# EAGLE design xplorer_t (EAGLE 6.3)
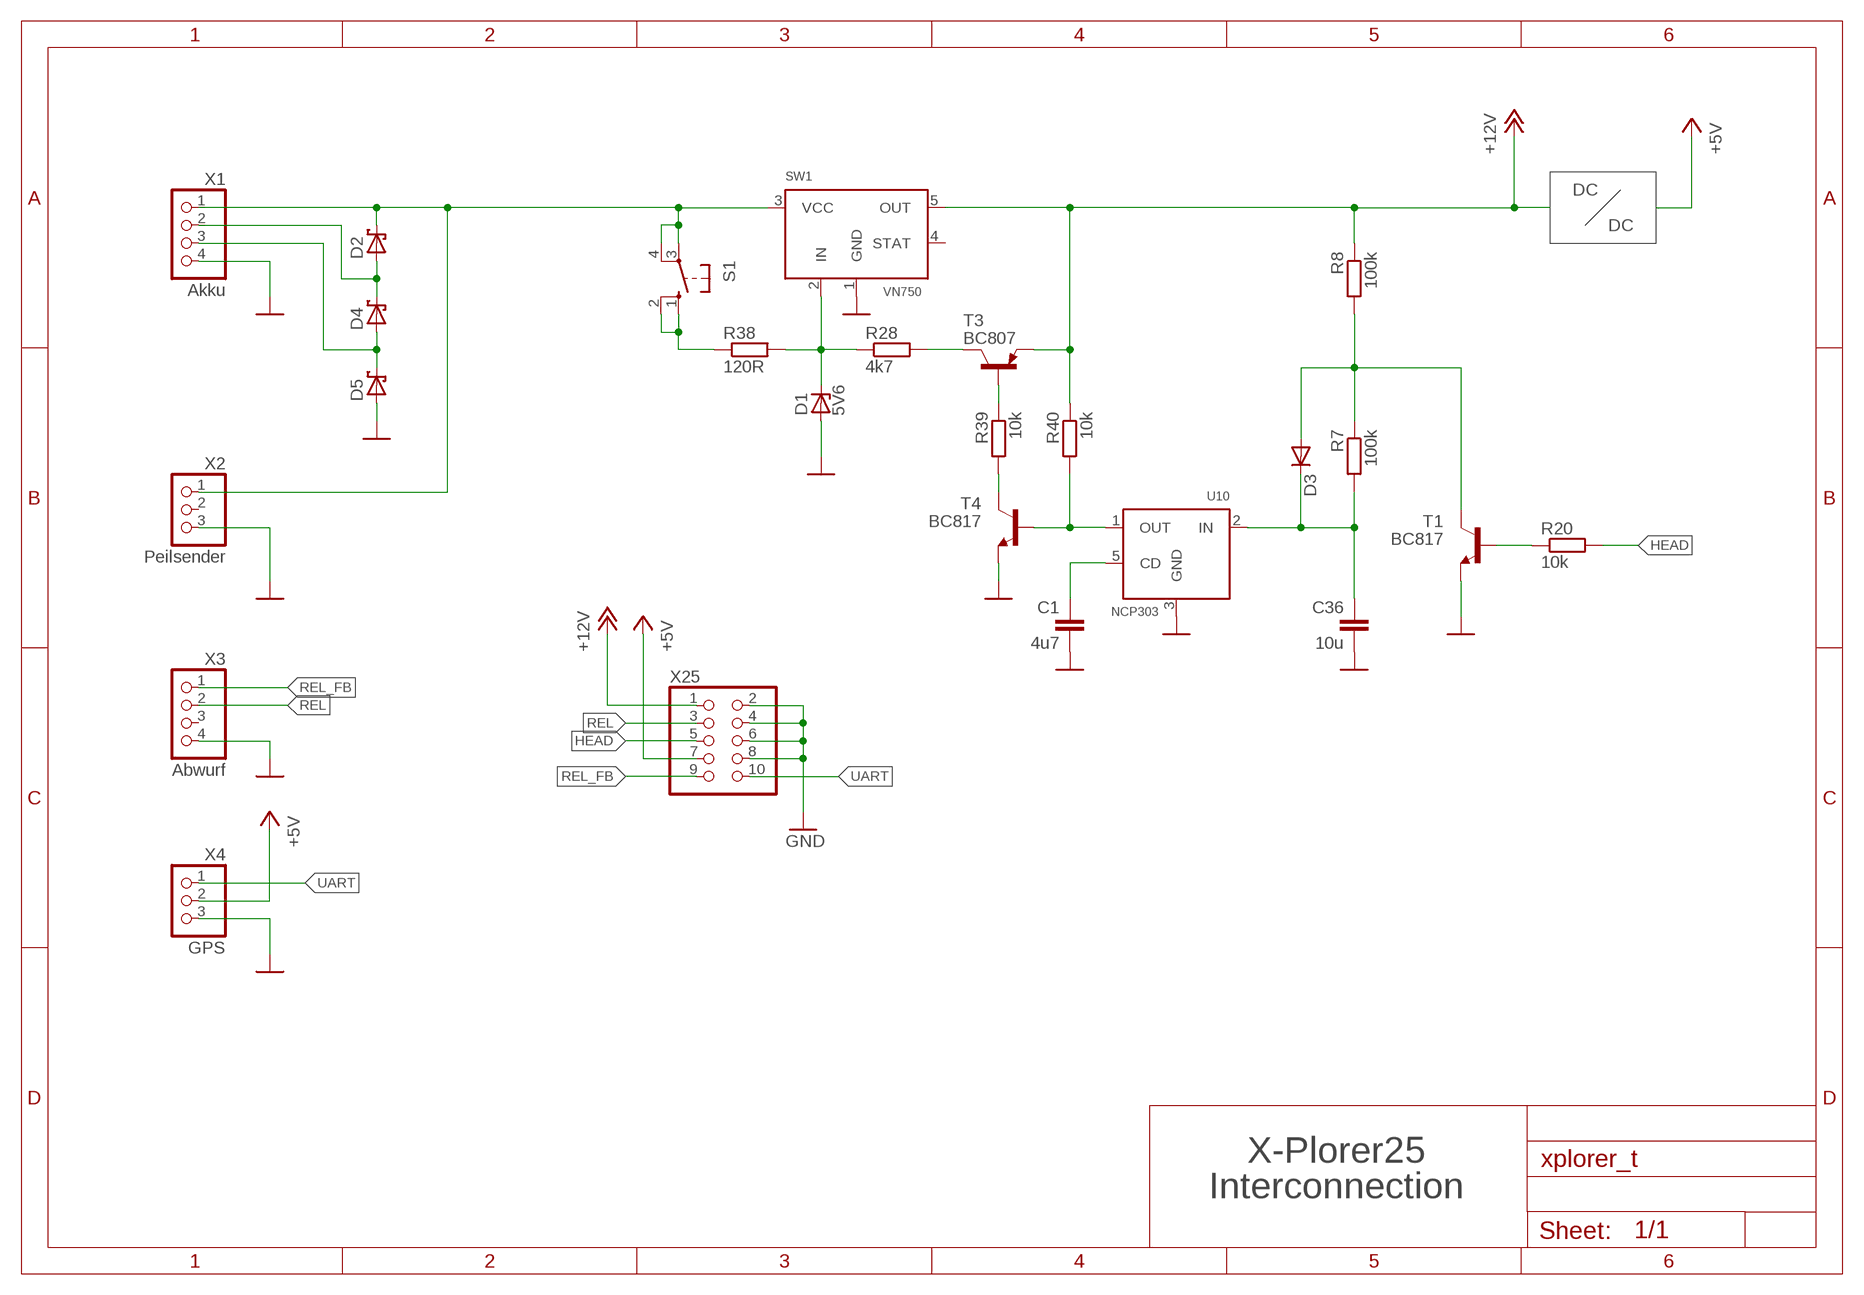
[diagram p0: schematic, sheet 1]

## Parts
C1  4u7  C-EUC1210  [C1210]
C36  10u  C-EUC1210  [C1210]
D1  5V6  ZENER-DIODESOT23  [SOT23]
D2  MBRS130LT3  [SMB]
D3  DIODE-MINIMELF  [MINIMELF]
D4  MBRS130LT3  [SMB]
D5  MBRS130LT3  [SMB]
R7  100k  R-EU_R0805  [R0805]
R8  100k  R-EU_R0805  [R0805]
R20  10k  R-EU_R0805  [R0805]
R28  4k7  R-EU_R0805  [R0805]
R38  120R  R-EU_R1206  [R1206]
R39  10k  R-EU_R0805  [R0805]
R40  10k  R-EU_R0805  [R0805]
S1  10-XX  [B3F-10XX]
SW1  VN750  [DDPAK]
T1  BC817  BC817-16LT1SMD  [SOT23-BEC]
T3  BC807  BC807-16LT1SMD  [SOT23-BEC]
T4  BC817  BC817-16LT1SMD  [SOT23-BEC]
U10  NCP303  [SOT23-DBV]
X1  Akku  PINHD-1X4  [1X04]
X2  Peilsender  PINHD-1X3/90  [1X03/90]
X3  Abwurf  PINHD-1X4/90  [1X04/90]
X4  GPS  PINHD-1X3  [1X03]
X25  PINHD-2X5  [2X05]

## Nets
+5V: X4.2 X25.7
+12V: R8.1 R40.1 SW1.5(OUT) T3.E X25.1
GND: C1.2 C36.2 D1.1(A) D5.A SW1.1(GND) T1.E T4.E U10.3(GND) X1.4 X2.3 X3.4 X4.3 X25.2 X25.4 X25.6 X25.8
HEAD: R20.2 X25.5
N$1: C1.1 U10.5(CD)
N$2: D2.A D4.C X1.2
N$3: D4.A D5.C X1.3
N$13: R38.1 S1.1(S) S1.2(S1)
N$25: C36.1 D3.C R7.2 U10.2(IN)
N$30: D2.C S1.3(P) S1.4(P1) SW1.3(VCC) X1.1 X2.1
N$45: D1.3(C) R28.1 R38.2 SW1.2(IN)
N$56: D3.A R7.1 R8.2 T1.C
N$59: R28.2 T3.C
N$60: R20.1 T1.B
N$61: R39.2 T4.C
N$62: R39.1 T3.B
N$63: R40.2 T4.B U10.1(OUT)
REL: X3.2 X25.3
REL_FB: X3.1 X25.9
UART: X4.1 X25.10
Unconnected: SW1.4(STAT) X2.2 X3.3

## Notes on the sheet
- DC
- DC
- X-Plorer25
- Interconnection

## Library data of the parts
C1 C36 = rcl:C-EU: CAPACITOR, European symbol
D1 = diode:ZENER-DIODE: Z-Diode
D2 D4 D5 = diode:MBRS130LT3: Schottky Power Rectifier Source: http://www.onsemi.com/pub/Collateral/MBRS130LT3-D.PDF
D3 = diode:DIODE-: DIODE
R7 R8 R20 R28 R38-R40 = rcl:R-EU_: RESISTOR, European symbol
S1 = switch-omron:10-XX: OMRON SWITCH; MPN: B3F-1000; OC_FARNELL: 176432; OC_NEWARK: 36M3542
SW1 = VN750:VN750
T1 T4 = transistor-npn:BC817*: NPN Transistor
T3 = transistor-pnp:BC807*: PNP Transistror
U10 = NCP303:NCP303
X1 X3 = pinhead:PINHD-1X4: PIN HEADER
X2 X4 = pinhead:PINHD-1X3: PIN HEADER
X25 = pinhead:PINHD-2X5: PIN HEADER

## Board
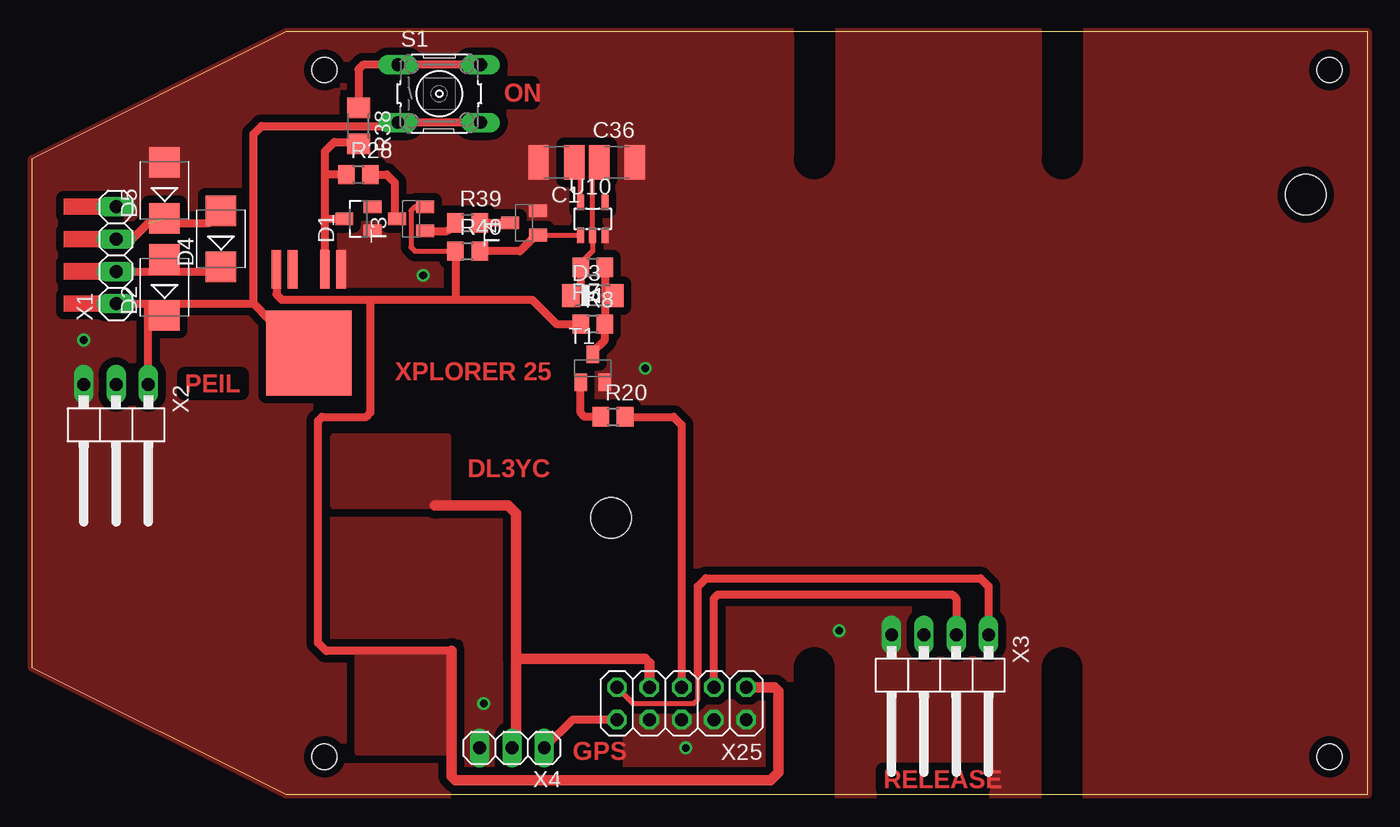
[diagram p1: board, top side]
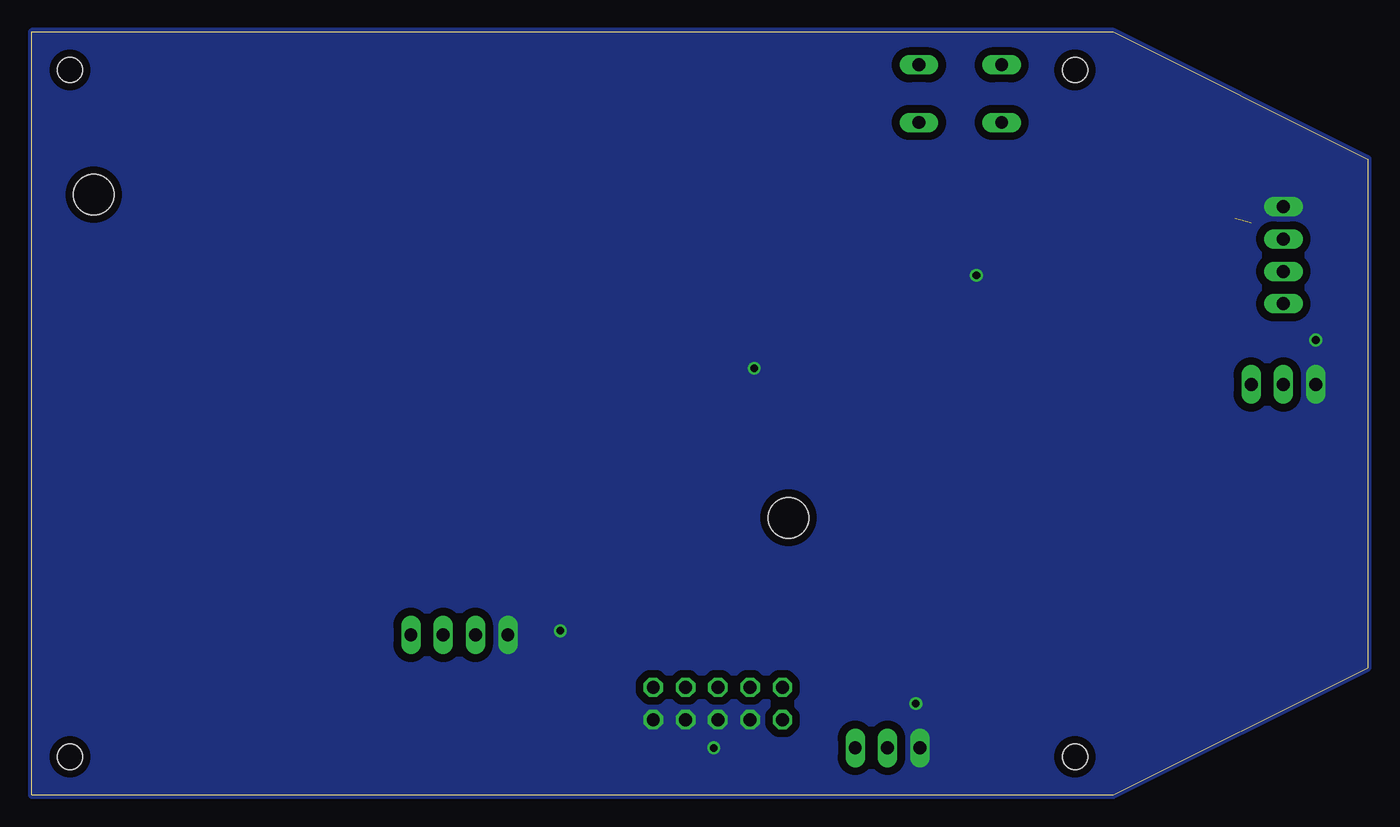
[diagram p2: board, bottom side, seen from below]

Size 105 x 60 mm. Coordinates in mm from the lower left corner, seen from the top.
Outline: 105,0 105,60 20,60 0,50 0,10 20,0 105,0
Copper layers (1*16): Top 0.035mm / dielectric 1.5mm / Bottom 0.035mm
Design rules "default *": minimum track width 10mil, minimum drill 24mil, track to track 8mil, track to pad 8mil, pad to pad 8mil, via to via 8mil, smd to smd 8mil, copper to edge 0mil, drill to drill 8mil, minimum pad ring 10mil, minimum via ring 8mil, stop-mask expansion 4mil, vias tented up to drill 0mil, thermal gap 10mil
Holes 3.2 mm at 45.52,21.8 100.13,47.2
Holes 2 mm at 102,57 102,3 23,57 23,3
tKeepout: area 48.5,15 to 96.5,45; area 12.2,7 to 42.2,29
tRestrict: 4 lines

### Footprints (pad centres in the part's own frame; a part is rotated, then mirrored left to right if it is on the bottom)
C1210 = smd 1.6 x 2.7: 1 -1.4,0; 2 1.4,0
SOT23 = smd 1 x 1.4: 1 -0.95,-1.1; 2 0.95,-1.1; 3 0,1.1
SMB = smd 2.4 x 2.4: A 2.2,0; C -2.2,0
MINIMELF = smd 1.4 x 1.8: A 1.7,0; C -1.7,0
R0805 = smd 1.3 x 1.5: 1 -0.95,0; 2 0.95,0
R1206 = smd 1.6 x 1.803: 1 -1.422,0; 2 1.422,0
B3F-10XX = drill 1.016 long: 1 -3.251,2.261; 2 3.251,2.261; 3 -3.251,-2.261; 4 3.251,-2.261
DDPAK = smd 3 x 0.76: 1 0,2.54; 2 0,1.27; 4 0,-1.27; 5 0,-2.54 | smd 6.7 x 6.7: 3 6.58,0
SOT23-BEC = smd 1 x 1.4: B -0.95,-1.1; C 0,1.1; E 0.95,-1.1
SOT23-DBV = smd 0.55 x 1.2: 1 -0.95,-1.3; 2 0,-1.3; 3 0.95,-1.3; 4 0.95,1.3; 5 -0.95,1.3
1X04 = drill 1.016 long: 1 -3.81,0; 2 -1.27,0; 3 1.27,0; 4 3.81,0
1X03/90 = drill 1.016 long: 1 -2.54,-3.81; 2 0,-3.81; 3 2.54,-3.81
1X04/90 = drill 1.016 long: 1 -3.81,-3.81; 2 -1.27,-3.81; 3 1.27,-3.81; 4 3.81,-3.81
1X03 = drill 1.016 long: 1 -2.54,0; 2 0,0; 3 2.54,0
2X05 = drill 1.016 octagon: 1 -5.08,-1.27; 2 -5.08,1.27; 3 -2.54,-1.27; 4 -2.54,1.27; 5 0,-1.27; 6 0,1.27; 7 2.54,-1.27; 8 2.54,1.27; 9 5.08,-1.27; 10 5.08,1.27

### Placement (x,y rotation side)
C1  41.23,49.74 180 top
C36  46,49.74 0 top
D1  25.68,45.29 90 top
D2  10.44,39.89 90 top
D3  44.09,39.26 0 top
D4  14.88,43.7 90 top
D5  10.44,47.52 90 top
R7  44.09,41.48 180 top
R8  44.09,37.04 0 top
R20  45.68,29.73 0 top
R28  25.68,48.78 0 top
R38  25.68,52.59 270 top
R39  34.25,44.98 0 top
R40  34.25,42.75 0 top
S1  32.02,55.13 0 top
SW1  21.77,41.32 270 top
T1  44.09,33.55 0 top
T3  29.8,45.29 90 top
T4  38.69,44.98 90 top
U10  44.09,45.29 0 top
X1  6.62,42.44 90 top
X2  6.62,28.46 180 top
X3  71.4,8.78 180 top
X4  37.74,3.7 180 top
X25  51.08,7.19 180 top

### Tracks (layer width: path | path; a pad name or v marks a point on that pad's centre or on a via)
+5V
  Top 0.61: 48.53,10.37 48.22,10.69 | 38.06,4.02 X4.2
  Top 0.813: 38.06,10.69 38.06,22.12 37.42,22.75 31.71,22.75 | X25.7 48.53,10.37 | 48.22,10.69 38.06,10.69 | 38.06,10.69 38.06,4.02
  pour Top: 23.77,28.15 32.66,28.15 32.66,22.75 23.77,22.75
+12V
  Top 0.406: T3.E 30.12,46.24 29.8,45.93 29.8,43.07 30.12,42.75 R40.1
  Top 0.61: SW1.5 19.23,39.35 19.64,38.94 26.63,38.94 | 26.63,38.94 33.3,38.94 | 33.3,38.94 39.33,38.94 41.23,37.04 R8.1 | R40.1 33.3,38.95 33.3,38.94 | 32.98,11.32 23.14,11.32 22.5,11.95 22.5,29.42 22.82,29.73 26.31,29.73 26.63,30.05 26.63,38.94
  Top 0.813: X25.1 58.38,8.46 58.7,8.15 58.7,1.8 58.06,1.16 33.3,1.16 32.98,1.48 32.98,11.32
  pour Top: 25.68,11.32 32.98,11.32 32.98,3.38 25.68,3.38
GND  (via drill 0.6)
  other vias: 30.76,40.85 48.22,33.55 35.52,7.19 51.39,3.7 63.46,12.91 4.09,35.77
  pour Top (isolate 0.61, rank 2, no thermals): 0,50 20,60 105,60 105,0 20,0 0,10
  pour Bottom (isolate 0.61, rank 2, no thermals): 0,50 20,60 105,60 105,0 20,0 0,10
HEAD
  Top 0.61: R20.2 50.44,29.73 51.08,29.1 X25.5
N$1
  Top 0.406: U10.5 43.14,49.29 C1.1
N$2
  Top 0.61: X1.2 10.44,41.16 | 10.44,41.16 14.54,41.16 D4.C | D2.A 10.44,41.16
N$3  (1 unrouted)
  Top 0.61: X1.3 7.89,43.7 9.16,44.98 13.95,44.98 D4.A
N$13
  Top 0.61: S1.2 S1.1 26.03,57.4 25.68,57.04 R38.1
N$25
  Top 0.406: R7.2 43.45,41.8 43.45,42.12 44.09,42.75 U10.2 44.09,49.23 C36.1
  Top 0.61: R7.2 43.14,40.01 D3.C
N$30
  Top 0.61: X1.1 9.48,38.62 | 9.48,38.62 17.42,38.62 | 17.42,38.62 18.69,37.36 19.16,37.36 SW1.3 | 17.42,38.62 17.42,51.96 18.05,52.59 28.21,52.59 | 28.21,52.59 28.49,52.59 S1.3 | S1.4 28.49,52.87 28.21,52.59 | X2.1 9.16,38.31 9.32,38.47 | 9.32,38.47 9.48,38.62 | D2.C 10.1,37.7 9.32,38.47
N$45
  Top 0.61: SW1.2 23.05,45.29 | 23.05,45.29 23.05,48.78 | 23.05,48.78 23.05,50.6 23.77,51.33 25.52,51.33 R38.2 | D1.3 23.05,45.29 | R28.1 23.05,48.78
N$56
  Top 0.61: R7.1 45.04,39.26 | 45.04,39.26 R8.2 45.04,35.77 44.09,34.81 T1.C | D3.A 45.04,39.26
N$59
  Top 0.61: R28.2 27.9,48.78 28.53,48.15 28.53,45.46 T3.C
N$60
  Top 0.61: R20.1 43.45,29.73 43.14,30.05 T1.B
N$61
  Top 0.61: T4.C R39.2
N$62
  Top 0.61: T3.B 32.66,44.34 R39.1
N$63
  Top 0.406: U10.1 39.83,43.99 T4.B
  Top 0.61: T4.B 39.65,44.02 38.38,42.75 R40.2
REL
  Top 0.61: X25.3 53.61,15.45 53.93,15.77 72.35,15.77 72.66,15.45 X3.2
REL_FB
  Top 0.406: X25.9 47.27,7.19 52.03,7.19 52.34,7.51 52.34,9.41
  Top 0.61: 52.34,9.41 52.34,16.4 52.98,17.03 74.57,17.03 75.2,16.4 X3.1
UART
  Top 0.61: X25.10 42.5,5.92 X4.1
(copper drawn outside any net)
  shapes: Top area x4

### Text on the board
Top: ON | XPLORER 25 | PEIL | DL3YC | GPS | RELEASE